# EAGLE design T03_Schematic (EAGLE 7.1.0)
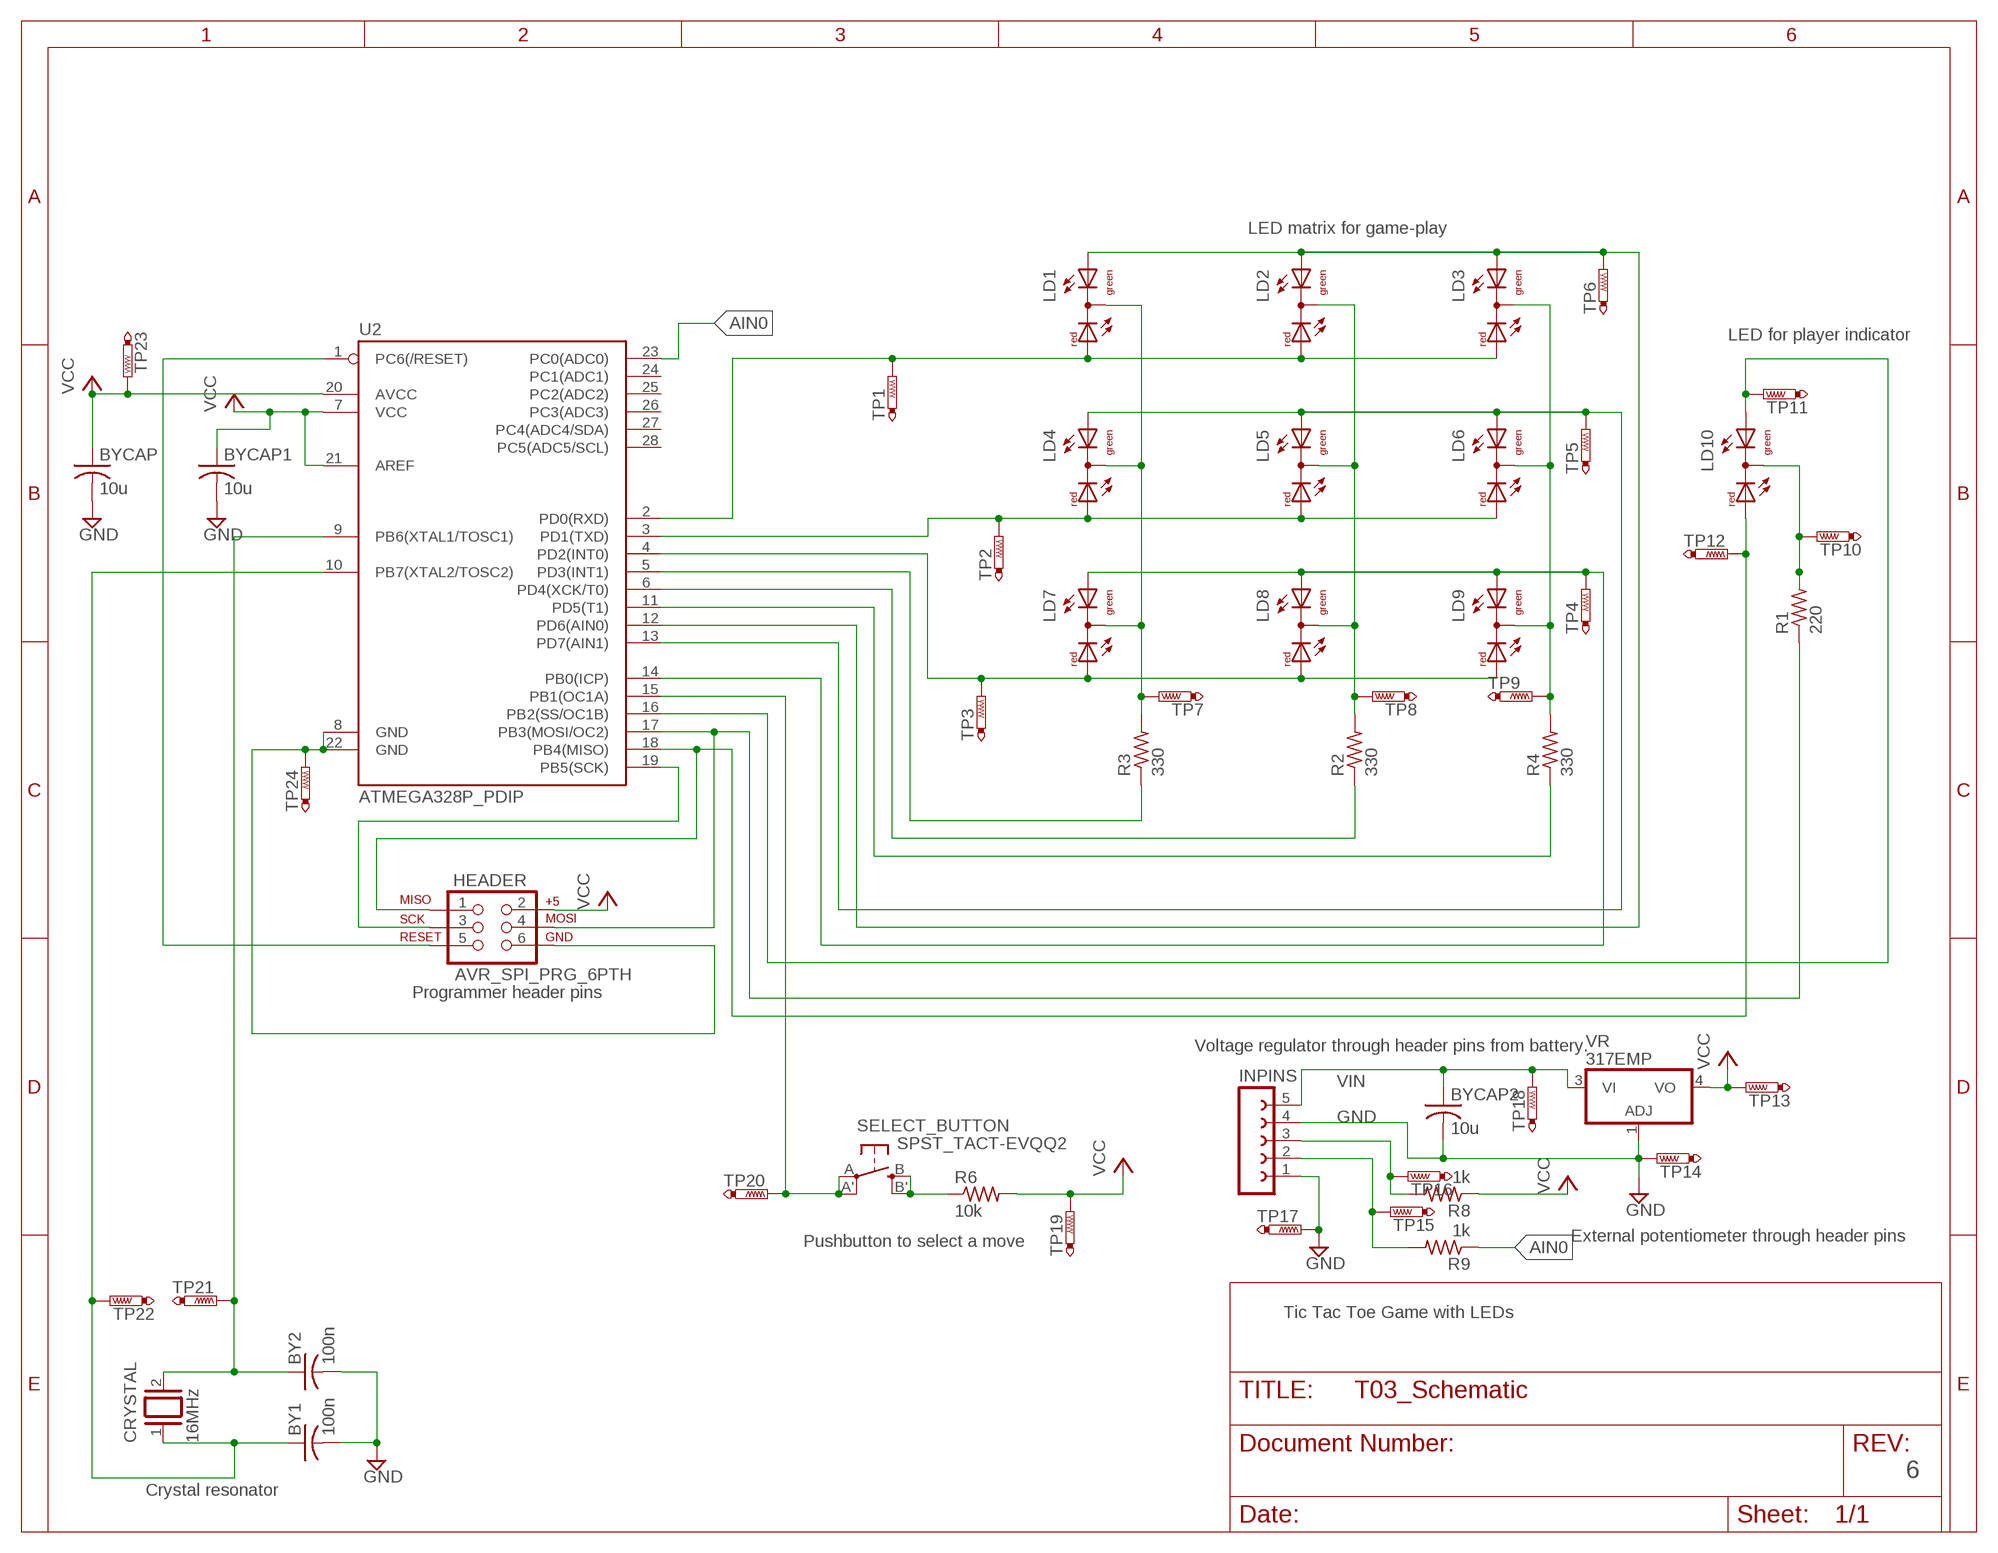
[diagram p0: schematic, sheet 1]

## Parts
BY1  100n  C-USC0805  [C0805]
BY2  100n  C-USC0805  [C0805]
BYCAP  10u  C-USC0805  [C0805]
BYCAP1  10u  C-USC0805  [C0805]
BYCAP2  10u  C-USC0805  [C0805]
CRYSTAL  16MHz  XTAL/S  [QS]
HEADER  AVR_SPI_PRG_6PTH  [2X3]
INPINS  FE05-1  [FE05-1]
LD1  DUOLED-RG-C  [DUOLED-C-5MM]
LD2  DUOLED-RG-C  [DUOLED-C-5MM]
LD3  DUOLED-RG-C  [DUOLED-C-5MM]
LD4  DUOLED-RG-C  [DUOLED-C-5MM]
LD5  DUOLED-RG-C  [DUOLED-C-5MM]
LD6  DUOLED-RG-C  [DUOLED-C-5MM]
LD7  DUOLED-RG-C  [DUOLED-C-5MM]
LD8  DUOLED-RG-C  [DUOLED-C-5MM]
LD9  DUOLED-RG-C  [DUOLED-C-5MM]
LD10  DUOLED-RG-C  [DUOLED-C-5MM]
R1  220  R-US_M0805  [M0805]
R2  330  R-US_M0805  [M0805]
R3  330  R-US_M0805  [M0805]
R4  330  R-US_M0805  [M0805]
R6  10k  R-US_M0805  [M0805]
R8  1k  R-US_M0805  [M0805]
R9  1k  R-US_M0805  [M0805]
SELECT_BUTTON  SPST_TACT-EVQQ2  [EVQ-Q2]
TP1  PTR1B1,27  [B1,27]
TP2  PTR1B1,27  [B1,27]
TP3  PTR1B1,27  [B1,27]
TP4  PTR1B1,27  [B1,27]
TP5  PTR1B1,27  [B1,27]
TP6  PTR1B1,27  [B1,27]
TP7  PTR1B1,27  [B1,27]
TP8  PTR1B1,27  [B1,27]
TP9  PTR1B1,27  [B1,27]
TP10  PTR1B1,27  [B1,27]
TP11  PTR1B1,27  [B1,27]
TP12  PTR1B1,27  [B1,27]
TP13  PTR1B1,27  [B1,27]
TP14  PTR1B1,27  [B1,27]
TP15  PTR1B1,27  [B1,27]
TP16  PTR1B1,27  [B1,27]
TP17  PTR1B1,27  [B1,27]
TP18  PTR1B1,27  [B1,27]
TP19  PTR1B1,27  [B1,27]
TP20  PTR1B1,27  [B1,27]
TP21  PTR1B1,27  [B1,27]
TP22  PTR1B1,27  [B1,27]
TP23  PTR1B1,27  [B1,27]
TP24  PTR1B1,27  [B1,27]
U2  ATMEGA328P_PDIP  [DIL28-3]
VR  317EMP  [SOT223]

## Nets
AIN0: R9.1 U2.23(PC0(ADC0))
CATH1: R3.1 U2.5(PD3(INT1))
CATH2: R2.1 U2.6(PD4(XCK/T0))
CATH3: R4.1 U2.11(PD5(T1))
CATH4: HEADER.4 R1.1 U2.17(PB3(MOSI/OC2))
GND: BY1.2 BY2.2 BYCAP1.2 BYCAP2.2 BYCAP.2 INPINS.1 INPINS.4 TP14.TP TP17.TP VR.1(ADJ)
GREN1: LD1.AX(AG) LD2.AX(AG) LD3.AX(AG) TP6.TP U2.12(PD6(AIN0))
GREN2: LD4.AX(AG) LD5.AX(AG) LD6.AX(AG) TP5.TP U2.13(PD7(AIN1))
GREN3: LD7.AX(AG) LD8.AX(AG) LD9.AX(AG) TP4.TP U2.14(PB0(ICP))
N$1: LD1.C LD4.C LD7.C R3.2 TP7.TP
N$2: R6.1 SELECT_BUTTON.B'(S1) SELECT_BUTTON.B(S)
N$3: LD2.C LD5.C LD8.C R2.2 TP8.TP
N$6: LD3.C LD6.C LD9.C R4.2 TP9.TP
N$8: HEADER.6 TP24.TP U2.8(GND) U2.22(GND)
N$10: LD10.C R1.2 TP10.TP
N$11: HEADER.3 U2.19(PB5(SCK))
N$12: HEADER.5 U2.1(PC6(/RESET))
N$13: BY1.1 CRYSTAL.1 TP22.TP U2.10(PB7(XTAL2/TOSC2))
PLAY1: LD10.AX(AG) TP11.TP U2.16(PB2(SS/OC1B))
PLAY2: HEADER.1 LD10.AR TP12.TP U2.18(PB4(MISO))
RED1: LD1.AR LD2.AR LD3.AR TP1.TP U2.2(PD0(RXD))
RED2: LD4.AR LD5.AR LD6.AR TP2.TP U2.3(PD1(TXD))
RED3: LD7.AR LD8.AR LD9.AR TP3.TP U2.4(PD2(INT0))
SELECT: SELECT_BUTTON.A'(P1) SELECT_BUTTON.A(P) TP20.TP U2.15(PB1(OC1A))
SELECTPIN: INPINS.2 R9.2 TP15.TP
V+POT: INPINS.3 R8.2 TP16.TP
VCC: BYCAP1.1 BYCAP.1 HEADER.2 R6.2 R8.1 TP13.TP TP19.TP TP23.TP U2.7(VCC) U2.20(AVCC) U2.21(AREF) VR.4(VO)
VIN: BYCAP2.1 INPINS.5 TP18.TP VR.3(VI)
XTAL1: BY2.1 CRYSTAL.2 TP21.TP U2.9(PB6(XTAL1/TOSC1))
Unconnected: U2.24(PC1(ADC1)) U2.25(PC2(ADC2)) U2.26(PC3(ADC3)) U2.27(PC4(ADC4/SDA)) U2.28(PC5(ADC5/SCL))

## Notes on the sheet
- LED matrix for game-play
- LED for player indicator
- Programmer header pins
- Voltage regulator through header pins from battery.
- External potentiometer through header pins
- Pushbutton to select a move
- Tic Tac Toe Game with LEDs
- 6
- Crystal resonator

## Library data of the parts
BY1 BY2 BYCAP BYCAP1 BYCAP2 = adafruit:C-US: CAPACITOR, American symbol
CRYSTAL = special:XTAL/S: CRYSTAL
HEADER = SparkFun-Connectors:AVR_SPI_PRG_6: AVR ISP 6 Pin This is the reduced ISP connector for AVR programming. Common on Arduino. This footprint will take up less PCB space and can be used with a 10-pin to 6-pin adapter such as SKU: BOB-08508 **Special note about "TEST_POINT" package. The stop mask is on the top side, so if you want your programming test points to be on the bottom of your board, make sure to place this package on the bottom side of the board. This also ensure that the orientation to program from the bottom side will be correct.
INPINS = con-lsta:FE05-1: FEMALE HEADER; OC_FARNELL: unknown; OC_NEWARK: unknown
LD1-LD10 = led:DUOLED-RG-C: DUO LED 2 colors (red/green), 5 mm, round, common Cathode www.ligitek.com or other producers.
R1-R4 R6 R8 R9 = adafruit:R-US_: RESISTOR, American symbol
SELECT_BUTTON = adafruit:SPST_TACT: SMT 6mm switch, EVQQ2 series http://www.ladyada.net/library/eagle
TP1-TP24 = testpad:PTR1: TEST PIN
U2 = SparkFun-DigitalIC:ATMEGA328P_PDIP: uC used in the Arduino 32kb flash, 1k EEPROM, 2k SRAM This is the through-hole version of this chip.
VR = linear:*317: Positive VOLTAGE REGULATOR

## Board
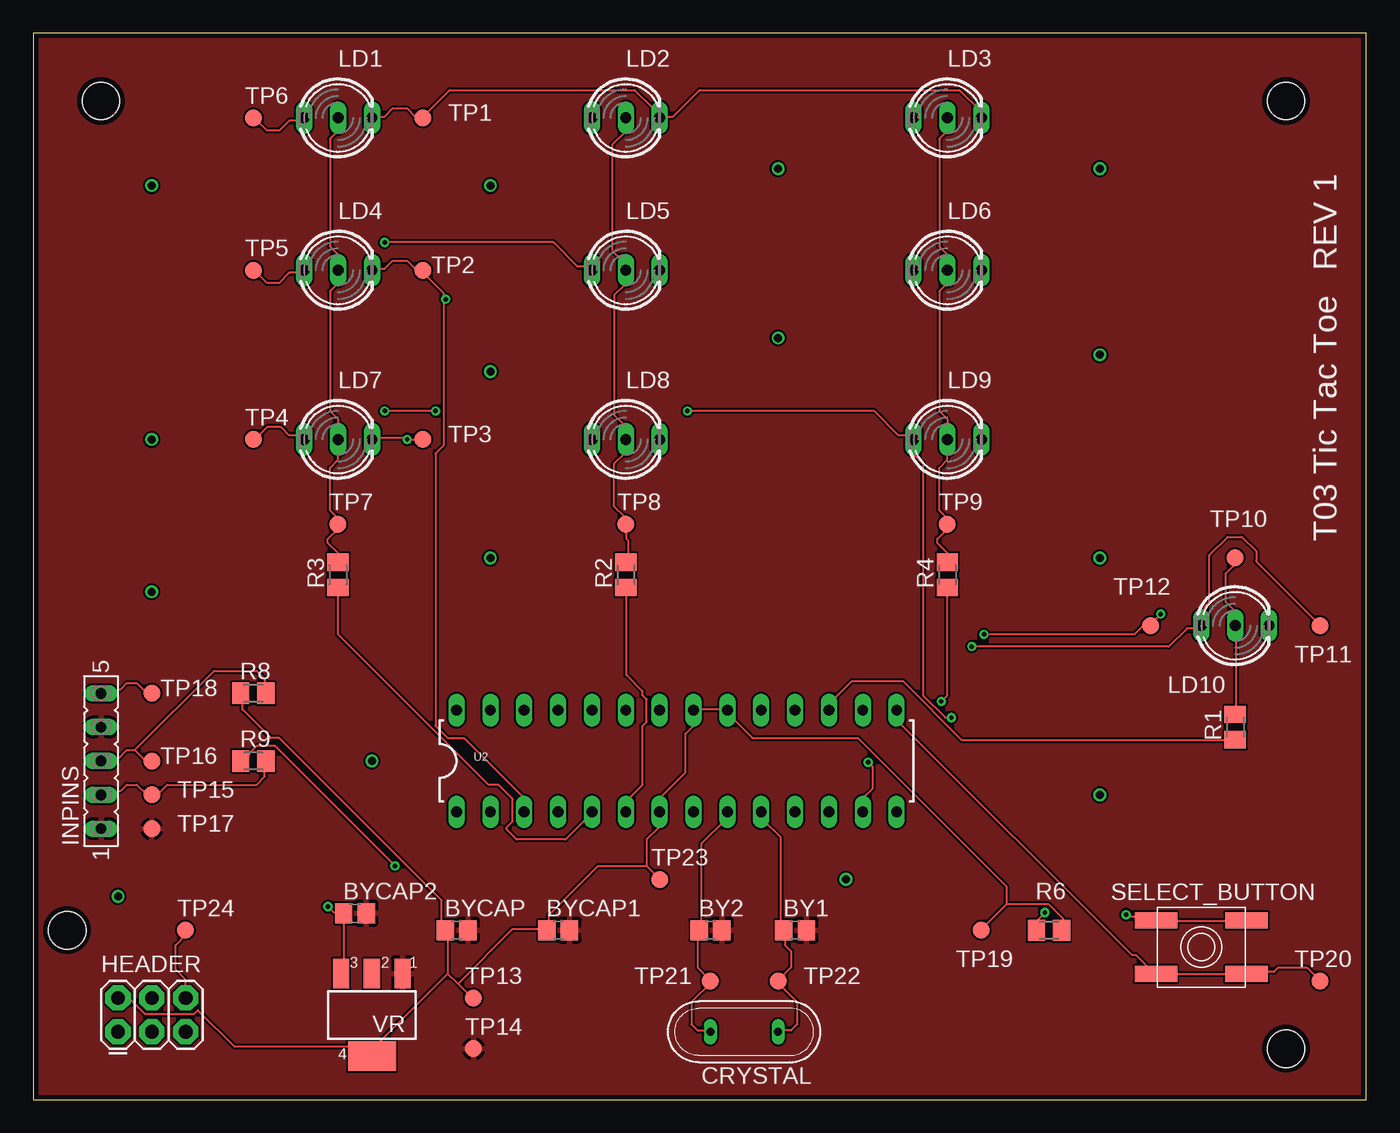
[diagram p1: board, top side]
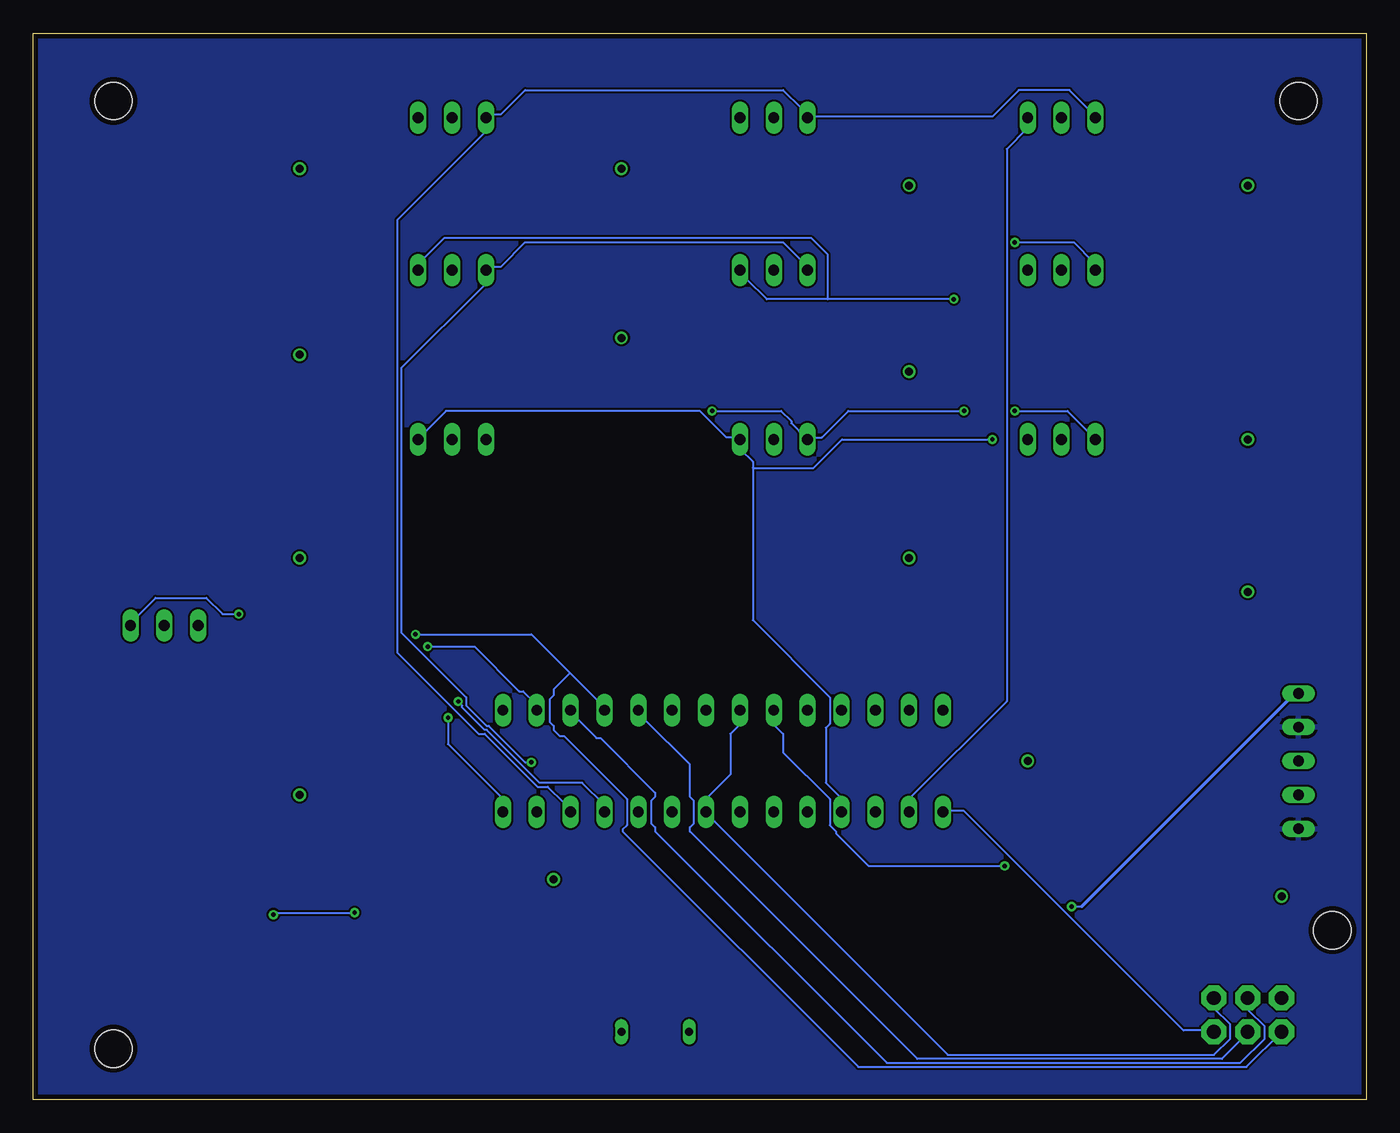
[diagram p2: board, bottom side, seen from below]

Size 100 x 80 mm. Coordinates in mm from the lower left corner, seen from the top.
Outline: 0,0 100,0 100,80 0,80 0,0
Copper layers (1*16): Top 0.0356mm / dielectric 1.5011mm / Bottom 0.0356mm
Design rules "OSH-Park-2-layer": minimum track width 6mil, minimum drill 13mil, track to track 6mil, track to pad 6mil, pad to pad 6mil, via to via 6mil, smd to smd 6mil, copper to edge 15mil, drill to drill 6mil, minimum pad ring 7mil, minimum via ring 7mil, stop-mask expansion 3mil, vias tented up to drill 0mil, thermal gap 10mil
Holes 2.8 mm at 5.08,74.93 93.98,74.93 93.98,3.81 2.54,12.7

### Footprints (pad centres in the part's own frame; a part is rotated, then mirrored left to right if it is on the bottom)
C0805 = smd 1.3 x 1.5: 1 -0.85,0; 2 0.85,0
QS = drill 0.61 long: 1 -2.54,0; 2 2.54,0
2X3 = drill 1.016 pad 1.88 octagon: 1 0,0; 2 0,2.54; 3 2.54,0; 4 2.54,2.54; 5 5.08,0; 6 5.08,2.54
FE05-1 = drill 0.813 long: 1 -5.08,0; 2 -2.54,0; 3 0,0; 4 2.54,0; 5 5.08,0
DUOLED-C-5MM = drill 0.813 long: AR 2.54,0; AX -2.54,0; C 0,0
M0805 = smd 1.3 x 1.6: 1 -0.95,0; 2 0.95,0
EVQ-Q2 = smd 3.2 x 1.2: A -3.4,-2; A' 3.4,-2; B -3.4,2; B' 3.4,2
B1,27 = smd 1.27 x 1.27: TP 0,0
DIL28-3 = drill 0.813 long: 1 -16.51,-3.81; 2 -13.97,-3.81; 3 -11.43,-3.81; 4 -8.89,-3.81; 5 -6.35,-3.81; 6 -3.81,-3.81; 7 -1.27,-3.81; 8 1.27,-3.81; 9 3.81,-3.81; 10 6.35,-3.81; 11 8.89,-3.81; 12 11.43,-3.81; 13 13.97,-3.81; 14 16.51,-3.81; 15 16.51,3.81; 16 13.97,3.81; 17 11.43,3.81; 18 8.89,3.81; 19 6.35,3.81; 20 3.81,3.81; 21 1.27,3.81; 22 -1.27,3.81; 23 -3.81,3.81; 24 -6.35,3.81; 25 -8.89,3.81; 26 -11.43,3.81; 27 -13.97,3.81; 28 -16.51,3.81
SOT223 = smd 1.219 x 2.235: 1 -2.311,-3.099; 2 0,-3.099; 3 2.311,-3.099 | smd 3.6 x 2.2: 4 0,3.099

### Placement (x,y rotation side)
BY1  57.15,12.7 0 top
BY2  50.8,12.7 0 top
BYCAP  31.75,12.7 0 top
BYCAP1  39.37,12.7 0 top
BYCAP2  24.13,13.97 0 top
CRYSTAL  53.34,5.08 180 top
HEADER  6.35,5.08 0 top
INPINS  5.08,25.4 90 top
LD1  22.86,73.66 0 top
LD2  44.45,73.66 0 top
LD3  68.58,73.66 0 top
LD4  22.86,62.23 0 top
LD5  44.45,62.23 0 top
LD6  68.58,62.23 0 top
LD7  22.86,49.53 0 top
LD8  44.45,49.53 0 top
LD9  68.58,49.53 0 top
LD10  90.17,35.56 0 top
R1  90.17,27.94 90 top
R2  44.45,39.37 90 top
R3  22.86,39.37 90 top
R4  68.58,39.37 90 top
R6  76.2,12.7 0 top
R8  16.51,30.48 0 top
R9  16.51,25.4 0 top
SELECT_BUTTON  87.63,11.43 0 top
TP1  29.21,73.66 0 top
TP2  29.21,62.23 0 top
TP3  29.21,49.53 0 top
TP4  16.51,49.53 0 top
TP5  16.51,62.23 0 top
TP6  16.51,73.66 0 top
TP7  22.86,43.18 0 top
TP8  44.45,43.18 0 top
TP9  68.58,43.18 0 top
TP10  90.17,40.64 0 top
TP11  96.52,35.56 0 top
TP12  83.82,35.56 0 top
TP13  33.02,7.62 0 top
TP14  33.02,3.81 0 top
TP15  8.89,22.86 0 top
TP16  8.89,25.4 0 top
TP17  8.89,20.32 0 top
TP18  8.89,30.48 0 top
TP19  71.12,12.7 0 top
TP20  96.52,8.89 0 top
TP21  50.8,8.89 0 top
TP22  55.88,8.89 0 top
TP23  46.99,16.51 0 top
TP24  11.43,12.7 0 top
U2  48.26,25.4 0 top
VR  25.4,6.35 180 top

### Tracks (layer width: path | path; a pad name or v marks a point on that pad's centre or on a via)
AIN0  (via drill 0.33)
  Top 0.152: v27.13,17.53 18.14,26.52 16.76,26.52 15.7,25.45 R9.1
  Bottom 0.152: v27.13,17.53 37.34,17.53 39.78,19.96 39.78,20.12 40.23,20.57 40.23,22.55 43.74,26.06 43.74,27.43 44.35,28.04 44.35,29.11 U2.23
CATH1
  Top 0.152: R3.1 22.86,34.9 34.14,23.62 34.9,23.62 35.97,22.55 35.97,20.88 35.51,20.42 35.51,20.27 36.27,19.51 39.93,19.51 41.91,21.49 U2.5
CATH2
  Top 0.152: R2.1 44.5,38.41 44.5,31.85 45.72,30.63 45.72,30.33 46.02,30.02 46.02,28.35 45.72,28.04 45.72,23.62 44.5,22.4 44.5,21.64 U2.6
CATH3  (via drill 0.33)
  Top 0.152: R4.1 68.58,30.33 v68.12,29.87
  Bottom 0.152: v68.12,29.87 67.82,29.57 67.82,29.41 66.14,27.74 65.99,27.74 62.03,23.77 58.83,23.77 57.15,22.1 U2.11
CATH4
  Top 0.152: R1.1 90.07,26.98 69.65,26.98 65.23,31.39 61.42,31.39 59.74,29.72 59.74,29.26 U2.17
  Bottom 0.152: HEADER.4 8.84,7.62 8.84,6.71 7.62,5.49 7.62,4.57 9.45,2.74 35.97,2.74 53.34,20.12 53.34,20.42 53.65,20.73 53.65,22.4 53.34,22.71 53.34,23.01 57.45,27.13 57.76,27.13 59.74,29.11 U2.17
GND
  pour Top: -1.27,81.28 -1.27,-1.27 101.6,-1.27 101.6,81.28
  pour Bottom: -2.54,81.28 -2.54,-2.54 102.87,-2.54 102.87,81.28
GREN1
  Top 0.152: LD1.AX 20.12,73.46 19.2,73.46 18.44,72.69 17.53,72.69 16.61,73.61 TP6.TP
  Bottom 0.152: 41.91,73.76 28.04,73.76 26.06,75.74 22.25,75.74 20.27,73.76 LD1.AX | U2.12 60.2,22.1 60.2,22.25 61.42,23.47 62.18,23.47 66.14,27.43 66.6,27.43 72.69,33.53 72.69,65.99 66.14,72.54 66.14,73.61 LD3.AX 65.99,73.76 65.84,73.91 64.92,73.91 63.09,75.74 43.74,75.74 42.37,74.37 42.37,74.22 41.91,73.76 | 41.91,73.76 LD2.AX
GREN2  (via drill 0.33)
  Top 0.152: LD4.AX 20.12,62.03 19.2,62.03 18.44,61.27 17.53,61.27 16.61,62.18 TP5.TP | v62.64,25.3 62.94,24.99 62.94,23.32 62.33,22.71 62.33,21.64 U2.13 | v26.36,64.31 39.01,64.31 40.84,62.48 41.76,62.48 41.91,62.33 LD5.AX
  Bottom 0.152: v62.64,25.3 63.09,25.3 65.84,28.04 65.99,28.04 67.51,29.57 67.51,30.18 72.39,35.05 72.39,54.86 66.14,61.11 66.14,62.18 LD6.AX 65.99,62.33 65.84,62.48 64.92,62.48 63.09,64.31 43.74,64.31 42.37,62.94 42.37,62.79 41.91,62.33 LD5.AX | v26.36,64.31 21.95,64.31 20.42,62.79 20.42,62.33 LD4.AX
GREN3  (via drill 0.33)
  Top 0.152: TP4.TP 16.61,49.53 17.53,50.44 18.59,50.44 19.2,49.84 19.96,49.84 20.27,49.53 LD7.AX | v68.89,28.65 68.43,28.65 66.75,30.33 66.75,47.7 66.14,48.31 66.14,49.53 LD9.AX 65.99,49.53 65.68,49.84 64.92,49.84 63.09,51.66 v49.07,51.66 | v30.18,51.66 v26.36,51.66
  Bottom 0.152: U2.14 64.77,22.55 68.89,26.67 v68.89,28.65 | 42.06,49.68 43.13,50.75 43.13,50.9 43.89,51.66 v49.07,51.66 | v26.36,51.66 22.4,51.66 20.73,49.99 20.73,49.84 20.42,49.53 LD7.AX | v30.18,51.66 38.86,51.66 40.84,49.68 42.06,49.68 | 42.06,49.68 LD8.AX
N$1
  Top 0.152: R3.2 22.86,41 22.1,41.76 22.1,42.06 22.86,42.82 TP7.TP 22.86,43.59 22.25,44.2 22.25,47.4 22.86,48.01 LD7.C 22.86,51.05 22.25,51.66 22.25,60.66 22.86,61.27 LD4.C 22.86,63.4 22.25,64.01 22.25,72.08 22.86,72.69 LD1.C
N$2  (via drill 0.33)
  Top 0.152: v75.89,14.02 75.29,13.41 75.29,12.8 R6.1 | v81.99,13.87 82.14,13.72 83.97,13.72 84.12,13.56 SELECT_BUTTON.B 84.28,13.41 90.98,13.41 SELECT_BUTTON.B'
  Bottom 0.152: v75.89,14.02 81.84,14.02 v81.99,13.87
N$3
  Top 0.152: R2.2 44.5,40.39 44.65,40.54 44.65,41.91 44.5,42.06 44.5,43.13 TP8.TP 44.35,43.28 44.35,43.74 43.59,44.5 43.59,47.7 44.35,48.46 44.35,49.53 | LD2.C 44.35,73.61 44.35,72.54 43.43,71.63 43.43,63.7 44.35,62.79 44.35,62.33 LD5.C 44.35,62.18 44.35,61.11 43.59,60.35 43.59,51.36 44.35,50.6 44.35,49.53 | 44.35,49.53 LD8.C
N$4  (via drill 0.6)
  other vias: 8.89,68.58
N$5  (via drill 0.6)
  other vias: 8.89,49.53
N$6
  Top 0.152: R4.2 68.58,41 67.82,41.76 67.82,42.06 68.58,42.82 TP9.TP 68.58,43.59 67.97,44.2 67.97,47.4 68.58,48.01 LD9.C 68.58,51.05 67.97,51.66 67.97,60.66 68.58,61.27 LD6.C 68.58,63.4 67.97,64.01 67.97,72.08 68.58,72.69 LD3.C
N$7  (via drill 0.6)
  other vias: 8.89,38.1
N$8
  Top 0.152: TP24.TP 11.43,12.34 10.67,11.58 10.67,9.75 11.43,8.99 HEADER.6
  Bottom 0.152: U2.22 47.09,29.11 47.09,28.04 47.7,27.43 47.7,24.38 49.53,22.55 U2.8 49.53,21.49 31.39,3.35 11.43,3.35 10.21,4.57 10.21,5.64 11.43,6.86 HEADER.6
N$9  (via drill 0.6)
  other vias: 34.29,68.58
N$10
  Top 0.152: TP10.TP 90.07,40.54 90.07,40.08 89.46,39.47 89.46,37.34 90.07,36.73 90.07,35.66 LD10.C 90.22,35.51 90.22,28.96 R1.2
N$11
  Bottom 0.152: U2.19 54.56,29.11 54.1,28.65 54.1,28.5 50.75,25.15 50.75,22.71 50.44,22.4 50.44,20.73 50.75,20.42 50.75,20.12 33.68,3.05 10.82,3.05 8.84,5.03 HEADER.3
N$12
  Bottom 0.152: U2.1 31.7,21.64 30.18,21.64 13.72,5.18 11.43,5.18 HEADER.5
N$13
  Top 0.152: CRYSTAL.1 55.93,5.18 56.84,5.18 57.3,5.64 57.3,7.32 55.78,8.84 TP22.TP 55.93,8.99 56.84,9.91 56.84,11.12 56.39,11.58 56.39,12.65 BY1.1 56.24,12.8 56.08,12.95 56.08,19.66 54.71,21.03 54.71,21.49 U2.10
N$14  (via drill 0.6)
  other vias: 34.29,54.61
N$15  (via drill 0.6)
  other vias: 34.29,40.64
N$16  (via drill 0.6)
  other vias: 55.88,69.85
N$17  (via drill 0.6)
  other vias: 55.88,57.15
N$18  (via drill 0.6)
  other vias: 80.01,69.85
N$19  (via drill 0.6)
  other vias: 80.01,55.88
N$20  (via drill 0.6)
  other vias: 80.01,40.64
N$21  (via drill 0.6)
  other vias: 6.35,15.24
N$22  (via drill 0.6)
  other vias: 60.96,16.51
N$23  (via drill 0.6)
  other vias: 80.01,22.86
N$24  (via drill 0.6)
  other vias: 25.4,25.4
PLAY1  (via drill 0.33)
  Top 0.152: TP11.TP 96.47,35.66 91.75,40.39 91.75,41.15 90.68,42.22 89.61,42.22 88.24,40.84 88.24,37.34 87.94,37.03 87.94,36.88 87.63,36.58 LD10.AX 87.63,35.51 87.48,35.36 86.56,35.36 85.19,33.98 v70.41,33.98
  Bottom 0.152: v70.41,33.98 66.9,33.98 63.55,30.63 63.25,30.63 62.33,29.72 62.33,29.26 U2.16
PLAY2  (via drill 0.33)
  Top 0.152: v84.58,36.42 83.82,35.66 TP12.TP 83.82,35.51 83.21,35.51 82.6,34.9 v71.32,34.9
  Bottom 0.152: v84.58,36.42 85.8,36.42 87.02,37.64 90.83,37.64 92.81,35.66 LD10.AR | 59.74,32 62.64,34.9 v71.32,34.9 | 59.74,32 57.61,29.87 57.61,29.72 57.15,29.26 U2.18 | HEADER.1 8.99,2.44 38.1,2.44 55.78,20.12 55.78,20.27 55.47,20.57 55.47,22.55 60.2,27.28 60.5,27.28 60.96,27.74 60.96,28.04 61.27,28.35 61.27,30.02 60.96,30.33 60.96,30.79 59.74,32
RED1
  Top 0.152: LD1.AR 25.45,73.76 26.36,73.76 26.98,74.37 28.04,74.37 28.65,73.76 29.11,73.76 TP1.TP 29.26,73.76 31.24,75.74 45.11,75.74 46.48,74.37 46.48,74.22 46.94,73.76 LD2.AR 47.09,73.76 48.01,73.76 49.99,75.74 69.49,75.74 71.02,74.22 71.02,73.76 LD3.AR
  Bottom 0.152: U2.2 34.29,22.55 26.98,29.87 26.98,71.32 25.45,72.85 25.45,73.61 LD1.AR
RED2  (via drill 0.33)
  Top 0.152: LD4.AR 25.45,62.33 26.36,62.33 26.98,62.94 28.04,62.94 28.65,62.33 29.11,62.33 TP2.TP 29.11,62.18 30.79,60.5 30.79,60.05 | 30.79,60.05 30.79,49.07 30.18,48.46 30.18,28.04 31.09,27.13 32.31,27.13 36.73,22.71 36.73,21.64 U2.3 | 30.79,60.05 v30.94,60.05
  Bottom 0.152: LD5.AR 46.48,61.72 46.48,61.57 44.96,60.05 40.39,60.05 | v30.94,60.05 40.39,60.05 | 40.39,60.05 40.39,63.4 41.6,64.62 69.19,64.62 71.02,62.79 71.02,62.33 LD6.AR
RED3  (via drill 0.33)
  Top 0.152: TP3.TP v28.04,49.53 27.89,49.68 25.6,49.68 25.45,49.53 LD7.AR
  Bottom 0.152: 46.02,47.4 46.02,47.85 46.94,48.77 46.94,49.53 LD8.AR 47.09,49.53 47.24,49.68 48.01,49.68 49.99,51.66 69.04,51.66 70.71,49.99 70.71,49.84 71.02,49.53 LD9.AR | 46.02,47.4 46.02,35.97 40.23,30.18 40.23,28.19 40.54,27.89 40.54,23.77 39.47,22.71 39.47,21.64 U2.4 | v28.04,49.53 39.32,49.53 41.45,47.4 46.02,47.4
SELECT
  Top 0.152: TP20.TP 96.47,8.99 95.56,9.91 93.42,9.91 93.12,9.6 91.29,9.6 91.14,9.45 SELECT_BUTTON.A' 90.98,9.45 84.28,9.45 SELECT_BUTTON.A 84.12,9.45 82.75,10.82 82.45,10.82 64.77,28.5 U2.15
SELECTPIN
  Top 0.152: INPINS.2 6.1,22.86 6.4,23.16 6.55,23.16 7.01,23.62 7.77,23.62 8.53,22.86 TP15.TP 9.3,22.86 10.06,23.62 16.76,23.62 17.37,24.23 17.37,25.3 R9.2
V+POT
  Top 0.152: 7.62,26.21 8.38,25.45 8.84,25.45 TP16.TP | 7.62,26.21 7.01,26.21 6.25,25.45 5.18,25.45 INPINS.3 | 7.62,26.21 13.56,32.16 16.76,32.16 17.37,31.55 17.37,30.48 R8.2
VCC
  Top 0.152: 73,14.63 71.17,12.8 TP19.TP | 73,14.63 76.2,14.63 77.27,13.56 77.27,12.8 R6.2 | 46.02,17.53 46.94,16.61 TP23.TP | 46.02,17.53 46.02,19.51 46.94,20.42 46.94,21.49 U2.7 47.09,21.64 47.09,22.71 48.92,24.54 48.92,27.43 49.53,28.04 U2.21 49.53,29.26 51.97,29.26 U2.20 51.97,29.11 53.95,27.13 61.87,27.13 73,16 73,14.63 | 31.09,9.45 31.85,8.69 | 31.85,8.69 32.92,7.62 TP13.TP | 31.09,9.45 31.09,12.5 30.94,12.65 BYCAP.1 30.79,12.8 30.63,12.95 30.63,14.94 18.44,27.13 17.83,27.13 15.7,29.26 15.7,30.48 R8.1 | 31.85,8.69 35.97,12.8 38.41,12.8 BYCAP1.1 38.56,12.8 38.71,12.95 38.71,13.87 42.37,17.53 46.02,17.53 | 31.09,9.45 25.6,3.96 | 25.6,3.96 25.45,3.81 25.45,3.35 VR.4 25.6,3.96 | HEADER.2 7.16,7.62 8.38,6.4 12.04,6.4 12.34,6.71 15.09,3.96 25.6,3.96
VIN  (via drill 0.33)
  Top 0.152: TP18.TP 8.53,30.48 7.77,31.24 7.01,31.24 6.55,30.79 6.4,30.79 6.1,30.48 INPINS.5 | VR.3 23.16,9.45 23.32,9.6 23.32,13.87 BYCAP2.1 23.16,14.02 22.55,14.02 v22.1,14.48
  Bottom 0.152: 5.79,30.02 5.64,30.02 5.18,30.48 INPINS.5 | v22.1,14.48 21.34,14.48
  Bottom 0.254: 21.34,14.48 5.79,30.02
XTAL1
  Top 0.152: CRYSTAL.2 50.75,5.18 49.84,5.18 49.38,5.64 49.38,7.32 50.9,8.84 TP21.TP 50.75,8.99 49.84,9.91 49.84,12.65 BY2.1 49.99,12.8 50.14,12.95 50.14,19.2 51.97,21.03 51.97,21.49 U2.9

### Text on the board
tPlace: REV 1 | T03 Tic Tac Toe